# Altium schematic sheet 2002_RTC.SchDoc
size A3; Author: Joao Marques Chaves; Organization: ETML-ES; Address1: Avenue Recordon 1; Address2: 1004 Lausanne; Address3: Switzerland; SheetNumber: 4; SheetTotal: 7; Version: C; SPICEModelCacheRYIINKWG: <root> / <DocumentId>RYIINKWG</DocumentId> / </root>
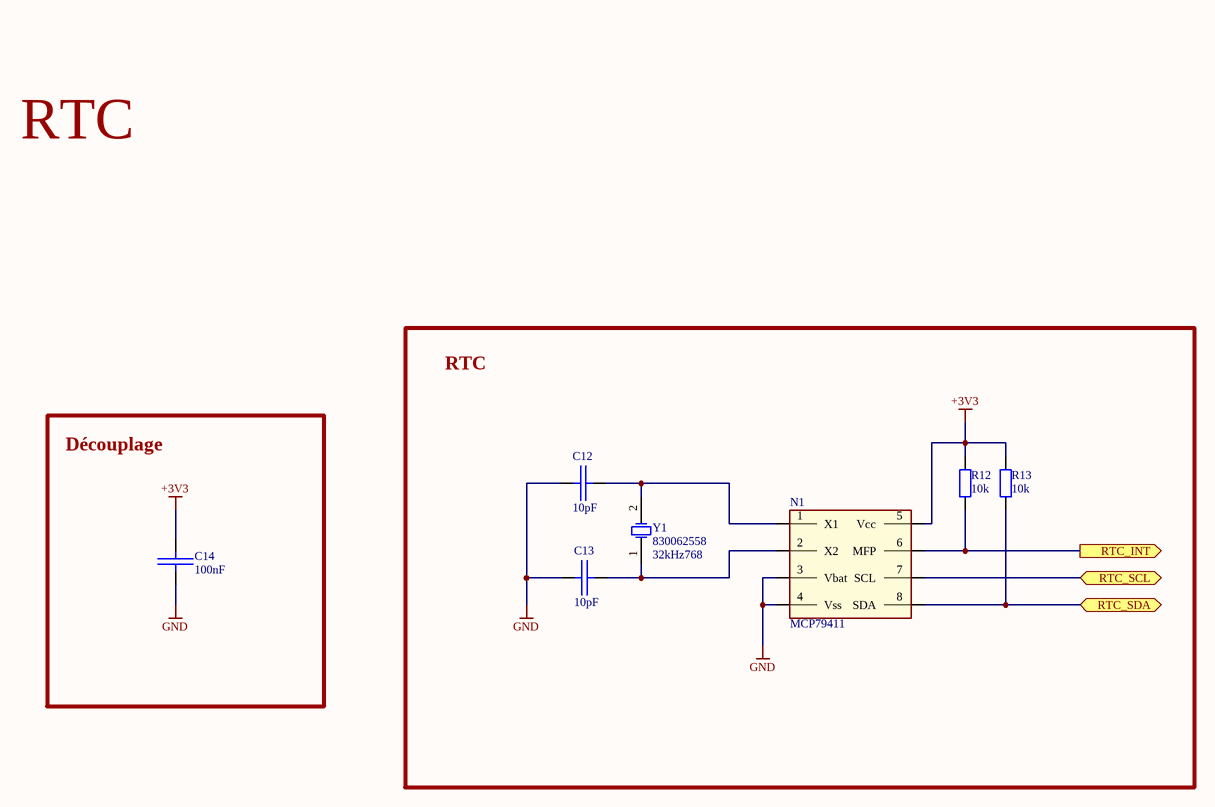
[diagram p0: 2002_RTC.SchDoc]

## Parts
C12  10pF  [0805]
C13  10pF  [0805]
C14  100nF  [0805]
N1  MCP79411  [MCP79411]
R12  10k  [0805]
R13  10k  [0805]
Y1  830062558  Frequency: 32kHz768  [WE-XTAL_IQXC-25]

## Blocks framed on the sheet
RTC: C12 C13 N1 R12 R13 Y1
Découplage: C14

## Ports
RTC_INT (out), RTC_SCL (bidir), RTC_SDA (bidir)

## Nets
+3V3: C14.1 N1.5(Vcc) R12.1 R13.1
GND: C12.1 C13.1 C14.2 N1.3(Vbat) N1.4(Vss)
RTC_INT: N1.6(MFP) R12.2 ; port RTC_INT
RTC_SCL: N1.7(SCL) ; port RTC_SCL
RTC_SDA: N1.8(SDA) R13.2 ; port RTC_SDA
NetC12_2: C12.2 N1.1(X1) Y1.2(OSC2)
NetC13_2: C13.2 N1.2(X2) Y1.1(OSC1)

## Notes on the sheet
- RTC
- Fichier :
- a
- Date :
- Heure :
- Version :
- Auteur :
- Modif.
- b
- c
- d
- Projet :
- No :
- Nb feuilles
- Feuille n°
- Chemin :

## Library data of the parts
C12-C14 = Condensator: 0805 Condensator
  C12 C13: Value: 10pF
  C14: Value: 100nF
N1 = MCP79411: RTC; ComponentLink1Description: distributeur; ComponentLink1URL: https://eu.mouser.com/ProductDetail/Microchip-Technology/MCP79411-I-MS?qs=ggQiQSXuoRWmeAUZm6kXJQ%3D%3D; ComponentLink2Description: Datasheet; ComponentLink2URL: https://eu.mouser.com/datasheet/2/268/MCP79410_MCP79411_MCP79412_Battery_Backed_I2C_RTCC-3359732.pdf
R12 R13 = CMP-2001-00528-1: SMD Resistor; Part Number: ERJ6ENF2703V; Manufacturer: Panasonic
Y1 = 830020423: Crystals WE-XTAL 32.7680kHz 20ppm 2.0 x 1.2mm; Manufacturer: Wurth Elektronik; Case/Size Code: HC49/4HSMX; Frequency Stability: +/-50ppm; Frequency Tolerance: +/-30ppm; Load Capacitance: 18pF; ComponentLink1Description: distributeur; ComponentLink1URL: https://eu.mouser.com/ProductDetail/Wurth-Elektronik/830062558?qs=2WXlatMagcGRj%2FV5lbTfrg%3D%3D; ComponentLink2Description: Datasheet; ComponentLink2URL: https://www.we-online.com/components/products/datasheet/830062558.pdf; Manufacturer Part Number: 830020423; Category: Crystals; Match Code: WE-XTAL; Mount: Surface Mount; Operating Temperature Max: 70°C; Operating Temperature Min: -20°C; Packaging: Tape and Reel; Length: 11.4mm; Width: 4.9mm; Height: 4.3mm